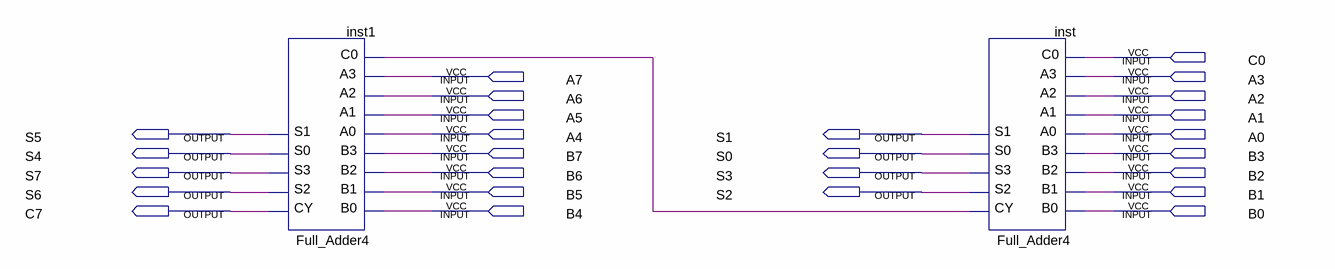
[diagram p0: schematic sheet]
// Quartus schematic Full_Adder8.bdf as structural Verilog: 2 symbols, 26 pins
module Full_Adder8 (
  input  C0,
  input  A7,
  input  A3,
  input  A6,
  input  A2,
  input  A5,
  input  A1,
  input  A4,
  input  A0,
  input  B7,
  input  B3,
  input  B6,
  input  B2,
  input  B5,
  input  B1,
  input  B4,
  input  B0,
  output S5,
  output S1,
  output S4,
  output S0,
  output S7,
  output S3,
  output S6,
  output S2,
  output C7
);

  wire inst_cy;

  Full_Adder4 inst1 (
    .B0(B4), .B1(B5), .B2(B6), .B3(B7), .A0(A4), .A1(A5), .A2(A6), .A3(A7), .C0(inst_cy), .CY(C7), .S2(S6),
    .S3(S7), .S0(S4), .S1(S5));
  Full_Adder4 inst (
    .B0(B0), .B1(B1), .B2(B2), .B3(B3), .A0(A0), .A1(A1), .A2(A2), .A3(A3), .C0(C0), .CY(inst_cy), .S2(S2),
    .S3(S3), .S0(S0), .S1(S1));
endmodule
